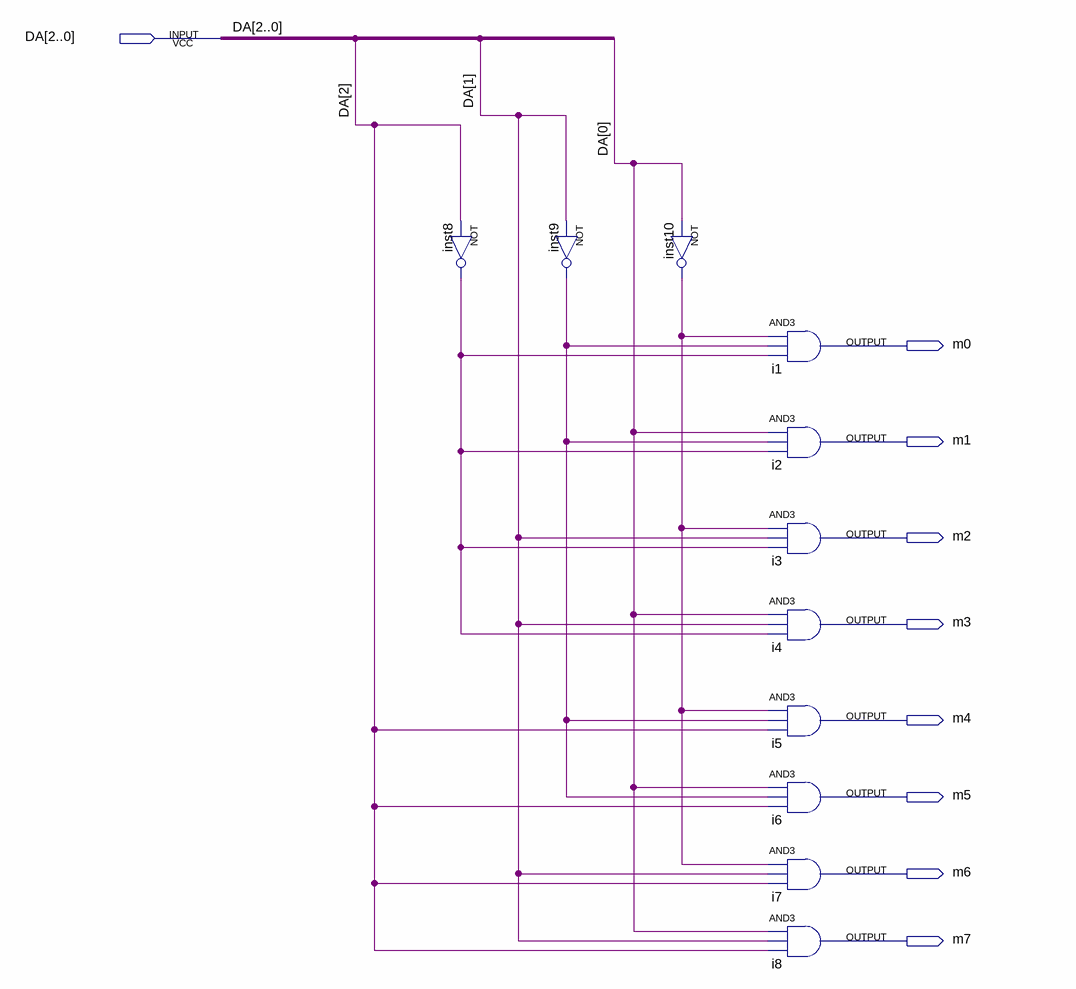
[diagram p0: schematic sheet]
// Quartus schematic 3to8Decoder.bdf as structural Verilog: 11 symbols, 9 pins
module \3to8Decoder  (
  input  [2:0] DA,
  output m0,
  output m1,
  output m2,
  output m3,
  output m4,
  output m5,
  output m6,
  output m7
);

  wire inst8_out, inst9_out, inst10_out;

  not inst8 (inst8_out, DA[2]);
  not inst9 (inst9_out, DA[1]);
  not inst10 (inst10_out, DA[0]);
  and i1 (m0, inst10_out, inst9_out, inst8_out);
  and i2 (m1, DA[0], inst9_out, inst8_out);
  and i3 (m2, inst10_out, DA[1], inst8_out);
  and i4 (m3, DA[0], DA[1], inst8_out);
  and i5 (m4, inst10_out, inst9_out, DA[2]);
  and i6 (m5, DA[0], inst9_out, DA[2]);
  and i7 (m6, inst10_out, DA[1], DA[2]);
  and i8 (m7, DA[0], DA[1], DA[2]);
endmodule
